# EAGLE schematic SwitchBoard (EAGLE 7.2.0)

## Sheet 1 of 5: Battery_Power
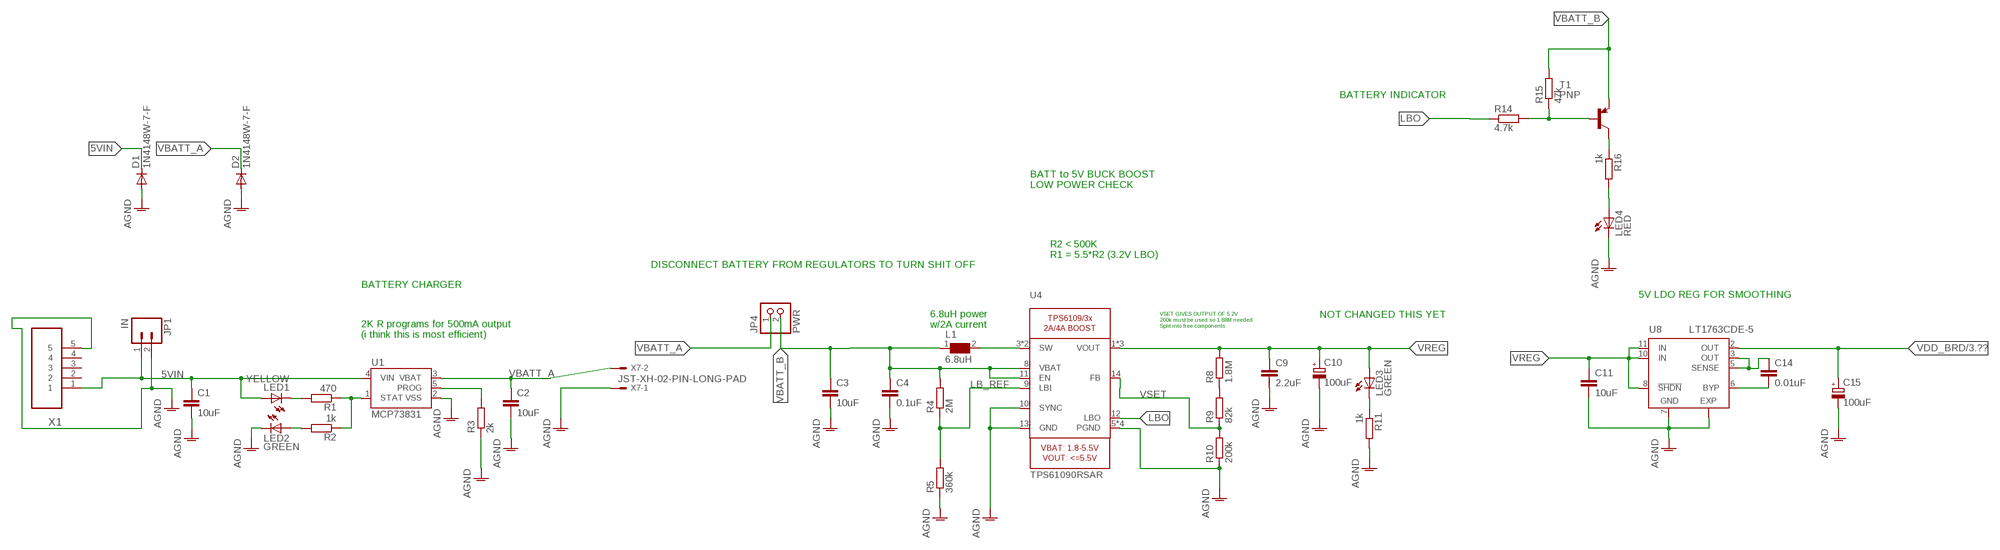
[diagram p0: schematic, sheet 1]

### Parts
C1  10uF  C-EUC0805  [C0805]
C2  10uF  C-EUC0805  [C0805]
C3  10uF  C-EUC0805  [C0805]
C4  0.1uF  C-EUC0805  [C0805]
C9  2.2uF  C-EUC0805  [C0805]
C10  100uF  CPOL-EUCT6032  [CT6032]
C11  10uF  C-EUC0805  [C0805]
C14  0.01uF  C-EUC0805  [C0805]
C15  100uF  CPOL-EUCT6032  [CT6032]
D1  1N4148W-7-F  DIODE-SOD123  [SOD123]
D2  1N4148W-7-F  DIODE-SOD123  [SOD123]
JP1  IN  M02PTH  [1X02]
JP4  PWR  PINHD-1X2  [1X02]
L1  6.8uH  WE-PD-7447779006_7332/7345_PLASTIC_BASE  [WE-PD_7332/7345_PLASTIC_BASE]
LED1  YELLOW  LEDSML0805  [SML0805]
LED2  GREEN  LEDSML0805  [SML0805]
LED3  GREEN  LEDSML0805  [SML0805]
LED4  RED  LEDSML0805  [SML0805]
R1  470  R-EU_M0805  [M0805]
R2  1k  R-EU_M0805  [M0805]
R3  2k  R-EU_M0805  [M0805]
R4  2M  R-EU_M0805  [M0805]
R5  360k  R-EU_M0805  [M0805]
R8  1.8M  R-EU_M0805  [M0805]
R9  82k  R-EU_M0805  [M0805]
R10  200k  R-EU_M0805  [M0805]
R11  1k  R-EU_M0805  [M0805]
R14  4.7k  R-EU_M0805  [M0805]
R15  47k  R-EU_M0805  [M0805]
R16  1k  R-EU_M0805  [M0805]
T1  PNP  BC807-40-PNP-SOT23-BEC  [SOT23-BEC]
U1  MCP73831  [SOT23-5]
U4  TPS61090RSAR  VREG_TPS6103XSPARKFUNVERSION  [QFN16-4X4]
U8  LT1763CDE-5  [DFN12]
X1  47346-0001  [MOLEX_47346-0001]
X7  JST-XH-02-PIN-LONG-PAD  [JST-XH-02-PACKAGE-LONG-PAD]

### Nets
5VIN: C1.1 D1.C JP1.1 LED1.A U1.4(VIN) X1.1
AGND: C1.2 C2.2 C3.2 C4.2 C9.2 C10.- C11.2 C15.- D1.A D2.A JP1.2 LED2.C LED4.C R3.1 R5.1 R10.1 R11.2 U1.2(VSS) U4.5(PGND) U4.6(PGND) U4.7(PGND) U4.10(SYNC) U4.13(GND) U4.EXP(PGND) U8.7(GND) U8.EXP X1.5 X7.1 ; also sheet 2,3,4
CHRG: LED1.C R1.2
LB_REF: R4.1 R5.2 U4.9(LBI)
LBO: R14.1 U4.12(LBO)
N$3: C14.1 U8.3(OUT) U8.5(SENSE)
N$4: C14.2 U8.6(BYP)
N$5: LED2.A R2.2
N$6: R8.1 R9.2
N$7: LED3.C R11.1
N$8: R16.1 T1.C
N$9: LED4.A R16.2
N$11: R14.2 R15.1 T1.B
PROG: R3.2 U1.5(PROG)
STAT: R1.1 R2.1 U1.1(STAT)
SW: L1.2 U4.3(SW) U4.4(SW)
VBATT_A: C2.1 D2.C JP4.1 U1.3(VBAT) X7.2
VBATT_B: C3.1 C4.1 JP4.2 L1.1 R4.2 R15.2 T1.E U4.8(VBAT) U4.11(EN)
VDD_BRD: C15.+ U8.2(OUT) ; also sheet 3,4
VREG: C9.1 C10.+ C11.1 LED3.A R8.2 U4.1(VOUT) U4.15(VOUT) U4.16(VOUT) U8.8(!SHDN) U8.10(IN) U8.11(IN)
VSET: R9.1 R10.2 U4.14(FB)
Unconnected: X1.2 X1.3 X1.4

### Notes on the sheet
- BATTERY INDICATOR
- BATT to 5V BUCK BOOST
  LOW POWER CHECK
- R2 < 500K
  R1 = 5.5*R2 (3.2V LBO)
- DISCONNECT BATTERY FROM REGULATORS TO TURN SHIT OFF
- BATTERY CHARGER
- 5V LDO REG FOR SMOOTHING
- NOT CHANGED THIS YET
- 6.8uH power
  w/2A current
- VSET GIVES OUTPUT OF 5.2V
  200k must be used so 1.88M needed
  Split into free components
- 2K R programs for 500mA output
  (i think this is most efficient)

## Sheet 2 of 5: Switches
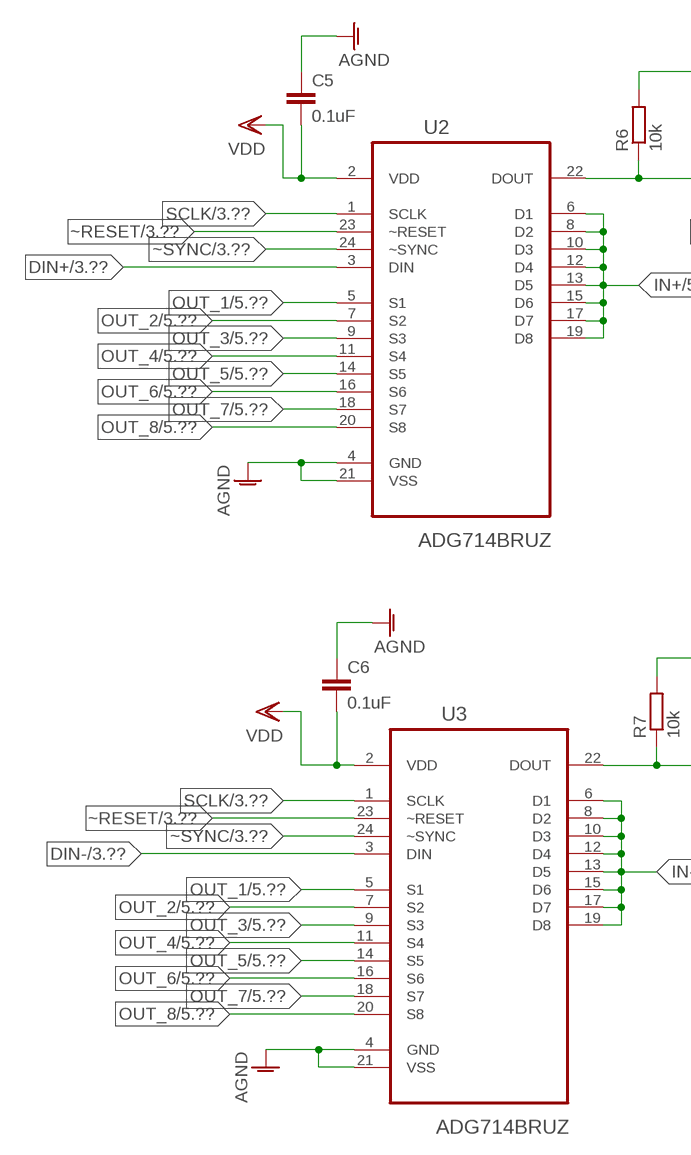
[diagram p1: schematic, sheet 2, part 1 of 2]
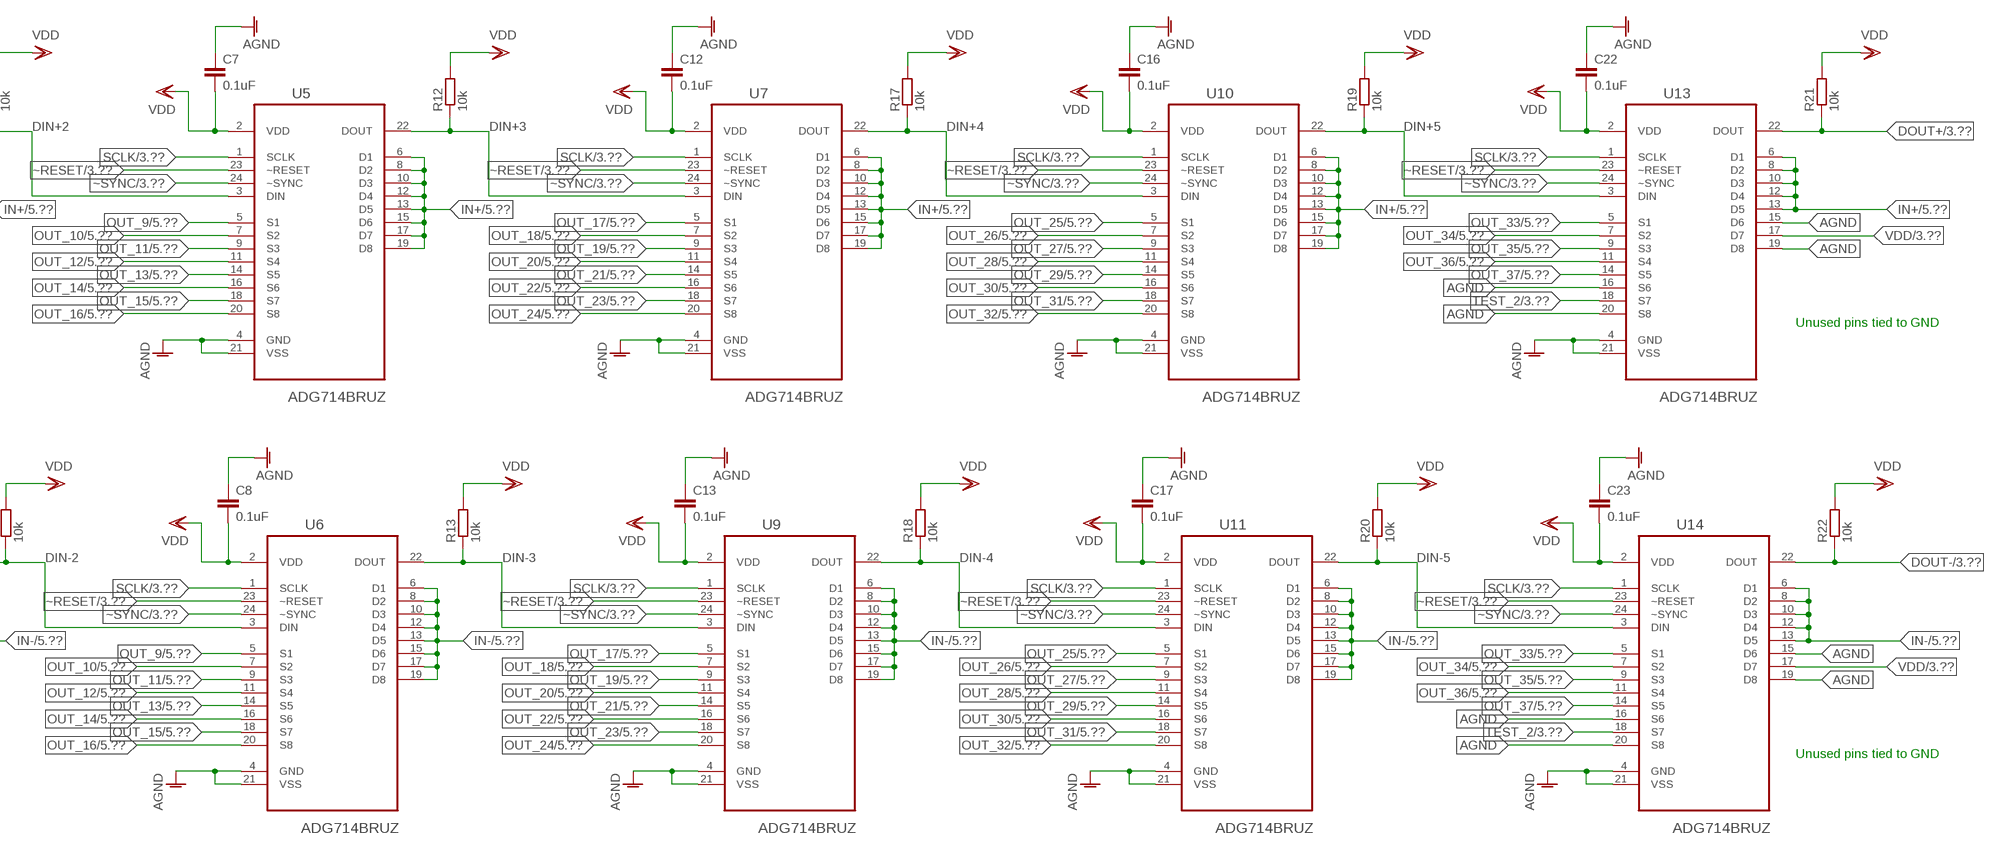
[diagram p2: schematic, sheet 2, part 2 of 2]

### Parts
C5  0.1uF  C-EUC0805  [C0805]
C6  0.1uF  C-EUC0805  [C0805]
C7  0.1uF  C-EUC0805  [C0805]
C8  0.1uF  C-EUC0805  [C0805]
C12  0.1uF  C-EUC0805  [C0805]
C13  0.1uF  C-EUC0805  [C0805]
C16  0.1uF  C-EUC0805  [C0805]
C17  0.1uF  C-EUC0805  [C0805]
C22  0.1uF  C-EUC0805  [C0805]
C23  0.1uF  C-EUC0805  [C0805]
R6  10k  R-EU_M0805  [M0805]
R7  10k  R-EU_M0805  [M0805]
R12  10k  R-EU_M0805  [M0805]
R13  10k  R-EU_M0805  [M0805]
R17  10k  R-EU_M0805  [M0805]
R18  10k  R-EU_M0805  [M0805]
R19  10k  R-EU_M0805  [M0805]
R20  10k  R-EU_M0805  [M0805]
R21  10k  R-EU_M0805  [M0805]
R22  10k  R-EU_M0805  [M0805]
U2  ADG714BRUZ  [SOP65P640X120-24N]
U3  ADG714BRUZ  [SOP65P640X120-24N]
U5  ADG714BRUZ  [SOP65P640X120-24N]
U6  ADG714BRUZ  [SOP65P640X120-24N]
U7  ADG714BRUZ  [SOP65P640X120-24N]
U9  ADG714BRUZ  [SOP65P640X120-24N]
U10  ADG714BRUZ  [SOP65P640X120-24N]
U11  ADG714BRUZ  [SOP65P640X120-24N]
U13  ADG714BRUZ  [SOP65P640X120-24N]
U14  ADG714BRUZ  [SOP65P640X120-24N]

### Nets
AGND: C5.1 C6.1 C7.1 C8.1 C12.1 C13.1 C16.1 C17.1 C22.1 C23.1 U2.4(GND) U2.21(VSS) U3.4(GND) U3.21(VSS) U5.4(GND) U5.21(VSS) U6.4(GND) U6.21(VSS) U7.4(GND) U7.21(VSS) U9.4(GND) U9.21(VSS) U10.4(GND) U10.21(VSS) U11.4(GND) U11.21(VSS) U13.4(GND) U13.15(D6) U13.16(S6) U13.19(D8) U13.20(S8) U13.21(VSS) U14.4(GND) U14.15(D6) U14.16(S6) U14.19(D8) U14.20(S8) U14.21(VSS) ; also sheet 1,3,4
DIN+: U2.3(DIN) ; also sheet 3
DIN+2: R6.1 U2.22(DOUT) U5.3(DIN)
DIN+3: R12.1 U5.22(DOUT) U7.3(DIN)
DIN+4: R17.1 U7.22(DOUT) U10.3(DIN)
DIN+5: R19.1 U10.22(DOUT) U13.3(DIN)
DIN-: U3.3(DIN) ; also sheet 3
DIN-2: R7.1 U3.22(DOUT) U6.3(DIN)
DIN-3: R13.1 U6.22(DOUT) U9.3(DIN)
DIN-4: R18.1 U9.22(DOUT) U11.3(DIN)
DIN-5: R20.1 U11.22(DOUT) U14.3(DIN)
DOUT+: R21.1 U13.22(DOUT) ; also sheet 3
DOUT-: R22.1 U14.22(DOUT) ; also sheet 3
IN+: U2.6(D1) U2.8(D2) U2.10(D3) U2.12(D4) U2.13(D5) U2.15(D6) U2.17(D7) U2.19(D8) U5.6(D1) U5.8(D2) U5.10(D3) U5.12(D4) U5.13(D5) U5.15(D6) U5.17(D7) U5.19(D8) U7.6(D1) U7.8(D2) U7.10(D3) U7.12(D4) U7.13(D5) U7.15(D6) U7.17(D7) U7.19(D8) U10.6(D1) U10.8(D2) U10.10(D3) U10.12(D4) U10.13(D5) U10.15(D6) U10.17(D7) U10.19(D8) U13.6(D1) U13.8(D2) U13.10(D3) U13.12(D4) U13.13(D5) ; also sheet 5
IN-: U3.6(D1) U3.8(D2) U3.10(D3) U3.12(D4) U3.13(D5) U3.15(D6) U3.17(D7) U3.19(D8) U6.6(D1) U6.8(D2) U6.10(D3) U6.12(D4) U6.13(D5) U6.15(D6) U6.17(D7) U6.19(D8) U9.6(D1) U9.8(D2) U9.10(D3) U9.12(D4) U9.13(D5) U9.15(D6) U9.17(D7) U9.19(D8) U11.6(D1) U11.8(D2) U11.10(D3) U11.12(D4) U11.13(D5) U11.15(D6) U11.17(D7) U11.19(D8) U14.6(D1) U14.8(D2) U14.10(D3) U14.12(D4) U14.13(D5) ; also sheet 5
OUT_1: U2.5(S1) U3.5(S1) ; also sheet 5
OUT_2: U2.7(S2) U3.7(S2) ; also sheet 5
OUT_3: U2.9(S3) U3.9(S3) ; also sheet 5
OUT_4: U2.11(S4) U3.11(S4) ; also sheet 5
OUT_5: U2.14(S5) U3.14(S5) ; also sheet 5
OUT_6: U2.16(S6) U3.16(S6) ; also sheet 5
OUT_7: U2.18(S7) U3.18(S7) ; also sheet 5
OUT_8: U2.20(S8) U3.20(S8) ; also sheet 5
OUT_9: U5.5(S1) U6.5(S1) ; also sheet 5
OUT_10: U5.7(S2) U6.7(S2) ; also sheet 5
OUT_11: U5.9(S3) U6.9(S3) ; also sheet 5
OUT_12: U5.11(S4) U6.11(S4) ; also sheet 5
OUT_13: U5.14(S5) U6.14(S5) ; also sheet 5
OUT_14: U5.16(S6) U6.16(S6) ; also sheet 5
OUT_15: U5.18(S7) U6.18(S7) ; also sheet 5
OUT_16: U5.20(S8) U6.20(S8) ; also sheet 5
OUT_17: U7.5(S1) U9.5(S1) ; also sheet 5
OUT_18: U7.7(S2) U9.7(S2) ; also sheet 5
OUT_19: U7.9(S3) U9.9(S3) ; also sheet 5
OUT_20: U7.11(S4) U9.11(S4) ; also sheet 5
OUT_21: U7.14(S5) U9.14(S5) ; also sheet 5
OUT_22: U7.16(S6) U9.16(S6) ; also sheet 5
OUT_23: U7.18(S7) U9.18(S7) ; also sheet 5
OUT_24: U7.20(S8) U9.20(S8) ; also sheet 5
OUT_25: U10.5(S1) U11.5(S1) ; also sheet 5
OUT_26: U10.7(S2) U11.7(S2) ; also sheet 5
OUT_27: U10.9(S3) U11.9(S3) ; also sheet 5
OUT_28: U10.11(S4) U11.11(S4) ; also sheet 5
OUT_29: U10.14(S5) U11.14(S5) ; also sheet 5
OUT_30: U10.16(S6) U11.16(S6) ; also sheet 5
OUT_31: U10.18(S7) U11.18(S7) ; also sheet 5
OUT_32: U10.20(S8) U11.20(S8) ; also sheet 5
OUT_33: U13.5(S1) U14.5(S1) ; also sheet 5
OUT_34: U13.7(S2) U14.7(S2) ; also sheet 5
OUT_35: U13.9(S3) U14.9(S3) ; also sheet 5
OUT_36: U13.11(S4) U14.11(S4) ; also sheet 5
OUT_37: U13.14(S5) U14.14(S5) ; also sheet 5
SCLK: U2.1(SCLK) U3.1(SCLK) U5.1(SCLK) U6.1(SCLK) U7.1(SCLK) U9.1(SCLK) U10.1(SCLK) U11.1(SCLK) U13.1(SCLK) U14.1(SCLK) ; also sheet 3
TEST_2: U13.18(S7) U14.18(S7) ; also sheet 3,4
VDD: C5.2 C6.2 C7.2 C8.2 C12.2 C13.2 C16.2 C17.2 C22.2 C23.2 R6.2 R7.2 R12.2 R13.2 R17.2 R18.2 R19.2 R20.2 R21.2 R22.2 U2.2(VDD) U3.2(VDD) U5.2(VDD) U6.2(VDD) U7.2(VDD) U9.2(VDD) U10.2(VDD) U11.2(VDD) U13.2(VDD) U13.17(D7) U14.2(VDD) U14.17(D7) ; also sheet 3,4
~RESET: U2.23(~RESET) U3.23(~RESET) U5.23(~RESET) U6.23(~RESET) U7.23(~RESET) U9.23(~RESET) U10.23(~RESET) U11.23(~RESET) U13.23(~RESET) U14.23(~RESET) ; also sheet 3
~SYNC: U2.24(~SYNC) U3.24(~SYNC) U5.24(~SYNC) U6.24(~SYNC) U7.24(~SYNC) U9.24(~SYNC) U10.24(~SYNC) U11.24(~SYNC) U13.24(~SYNC) U14.24(~SYNC) ; also sheet 3

### Notes on the sheet
- Unused pins tied to GND
- Unused pins tied to GND

## Sheet 3 of 5: Arduino_Comm
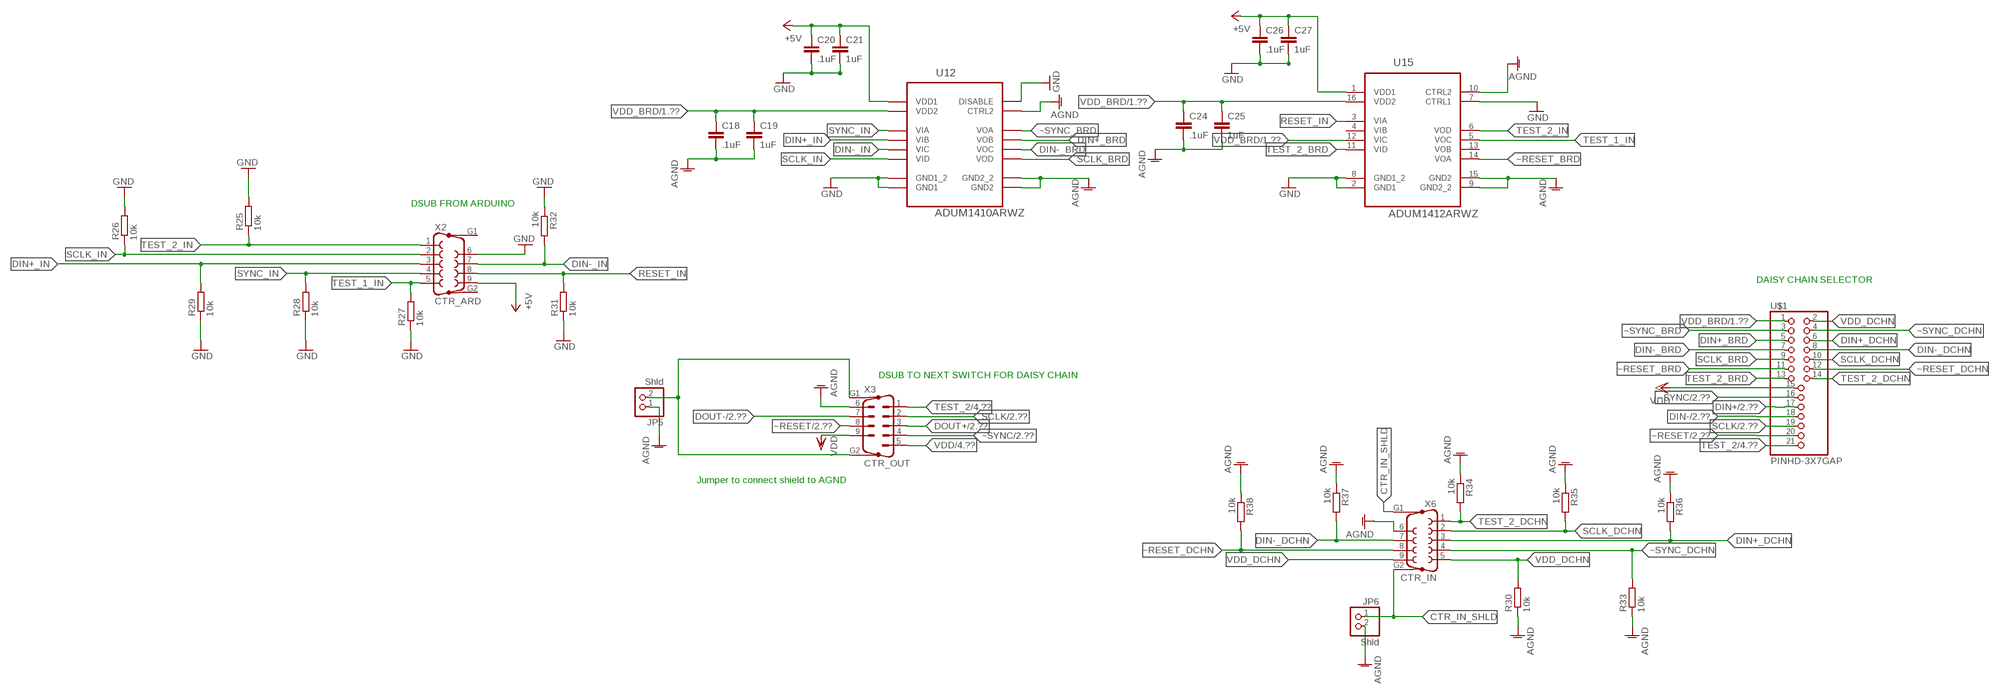
[diagram p3: schematic, sheet 3]

### Parts
C18  .1uF  C-EUC0805  [C0805]
C19  1uF  C-EUC0805  [C0805]
C20  .1uF  C-EUC0805  [C0805]
C21  1uF  C-EUC0805  [C0805]
C24  .1uF  C-EUC0805  [C0805]
C25  1uF  C-EUC0805  [C0805]
C26  .1uF  C-EUC0805  [C0805]
C27  1uF  C-EUC0805  [C0805]
JP5  Shld  PINHD-1X2  [1X02]
JP6  Shld  PINHD-1X2  [1X02]
R25  10k  R-EU_R0402  [R0402]
R26  10k  R-EU_R0402  [R0402]
R27  10k  R-EU_R0402  [R0402]
R28  10k  R-EU_R0402  [R0402]
R29  10k  R-EU_R0402  [R0402]
R30  10k  R-EU_R0402  [R0402]
R31  10k  R-EU_R0402  [R0402]
R32  10k  R-EU_R0402  [R0402]
R33  10k  R-EU_R0402  [R0402]
R34  10k  R-EU_R0402  [R0402]
R35  10k  R-EU_R0402  [R0402]
R36  10k  R-EU_R0402  [R0402]
R37  10k  R-EU_R0402  [R0402]
R38  10k  R-EU_R0402  [R0402]
U12  ADUM1410ARWZ  [SOIC127P1032X265-16N]
U15  ADUM1412ARWZ  [SOIC127P1032X265-16N]
U$1  PINHD-3X7GAP  [3X07]
X2  CTR_ARD  F09HP  [F09HP]
X3  CTR_OUT  M09HP  [M09HP]
X6  CTR_IN  F09HP  [F09HP]

### Nets
+5V: C20.1 C21.1 C26.1 C27.1 U12.1(VDD1) U15.1(VDD1) X2.9
AGND: C18.2 C19.2 C24.2 C25.2 JP5.1 JP6.2 R30.1 R33.1 R34.1 R35.1 R36.1 R37.1 R38.1 U12.9(GND2_2) U12.10(CTRL2) U12.15(GND2) U15.9(GND2_2) U15.10(CTRL2) U15.15(GND2) X3.6 X6.6 ; also sheet 1,2,4
CTR_IN_SHLD: JP6.1 X6.G1 X6.G2
DIN+: U$1.17 ; also sheet 2
DIN+_BRD: U12.13(VOB) U$1.5
DIN+_DCHN: R36.2 U$1.6 X6.3
DIN+_IN: R29.2 U12.4(VIB) X2.3
DIN-: U$1.18 ; also sheet 2
DIN-_BRD: U12.12(VOC) U$1.7
DIN-_DCHN: R37.2 U$1.8 X6.7
DIN-_IN: R32.2 U12.5(VIC) X2.7
DOUT+: X3.3 ; also sheet 2
DOUT-: X3.7 ; also sheet 2
GND: C20.2 C21.2 C26.2 C27.2 R25.2 R26.2 R27.1 R28.1 R29.1 R31.1 R32.1 U12.2(GND1_2) U12.7(DISABLE) U12.8(GND1) U15.2(GND1) U15.7(CTRL1) U15.8(GND1_2) X2.6
N$10: JP5.2 X3.G1 X3.G2
RESET_IN: R31.2 U15.3(VIA) X2.8
SCLK: U$1.19 X3.2 ; also sheet 2
SCLK_BRD: U12.11(VOD) U$1.9
SCLK_DCHN: R35.2 U$1.10 X6.2
SCLK_IN: R26.1 U12.6(VID) X2.2
SYNC_IN: R28.2 U12.3(VIA) X2.4
TEST_1_IN: R27.2 U15.5(VOC) X2.5
TEST_2: U$1.21 X3.1 ; also sheet 2,4
TEST_2_BRD: U15.11(VID) U$1.13
TEST_2_DCHN: R34.2 U$1.14 X6.1
TEST_2_IN: R25.1 U15.6(VOD) X2.1
VDD: U$1.15 X3.5 X3.9 ; also sheet 2,4
VDD_BRD: C18.1 C19.1 C24.1 C25.1 U12.16(VDD2) U15.12(VIC) U15.16(VDD2) U$1.1 ; also sheet 1,4
VDD_DCHN: R30.2 U$1.2 X6.5 X6.9
~RESET: U$1.20 X3.8 ; also sheet 2
~RESET_BRD: U15.14(VOA) U$1.11
~RESET_DCHN: R38.2 U$1.12 X6.8
~SYNC: U$1.16 X3.4 ; also sheet 2
~SYNC_BRD: U12.14(VOA) U$1.3
~SYNC_DCHN: R33.2 U$1.4 X6.4
Unconnected: U15.4(VIB) U15.13(VOB) X2.G1 X2.G2

### Notes on the sheet
- DSUB FROM ARDUINO
- DAISY CHAIN SELECTOR
- DSUB TO NEXT SWITCH FOR DAISY CHAIN
- Jumper to connect shield to AGND

## Sheet 4 of 5: Test_connections
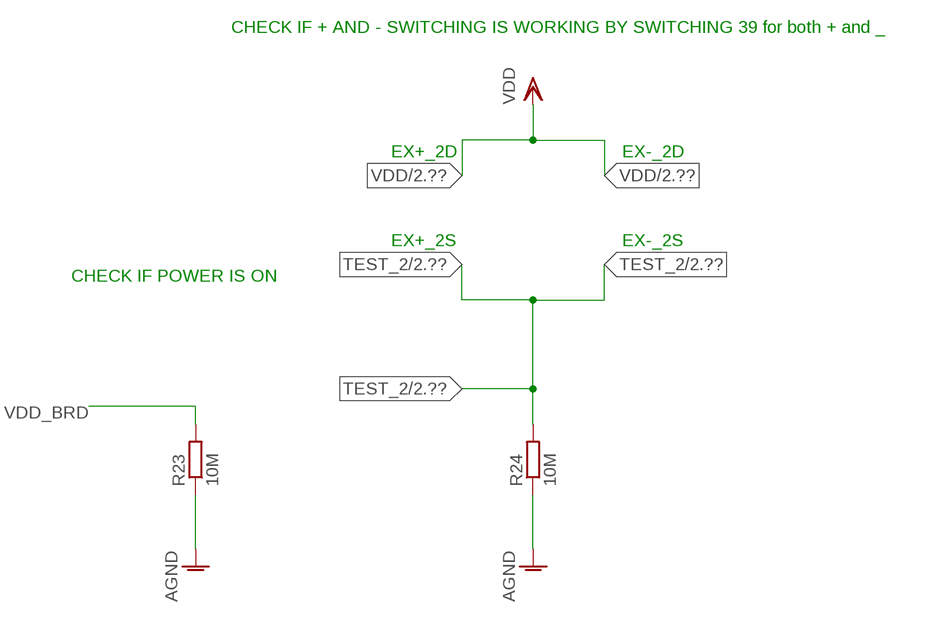
[diagram p4: schematic, sheet 4]

### Parts
R23  10M  R-EU_M0805  [M0805]
R24  10M  R-EU_M0805  [M0805]

### Nets
AGND: R23.1 R24.1 ; also sheet 1,2,3
TEST_2: R24.2 ; also sheet 2,3
VDD_BRD: R23.2 ; also sheet 1,3

### Notes on the sheet
- CHECK IF + AND - SWITCHING IS WORKING BY SWITCHING 39 for both + and _
- EX+_2D | EX-_2D
- EX+_2S | EX-_2S
- CHECK IF POWER IS ON

## Sheet 5 of 5: EEG_CS_Connections
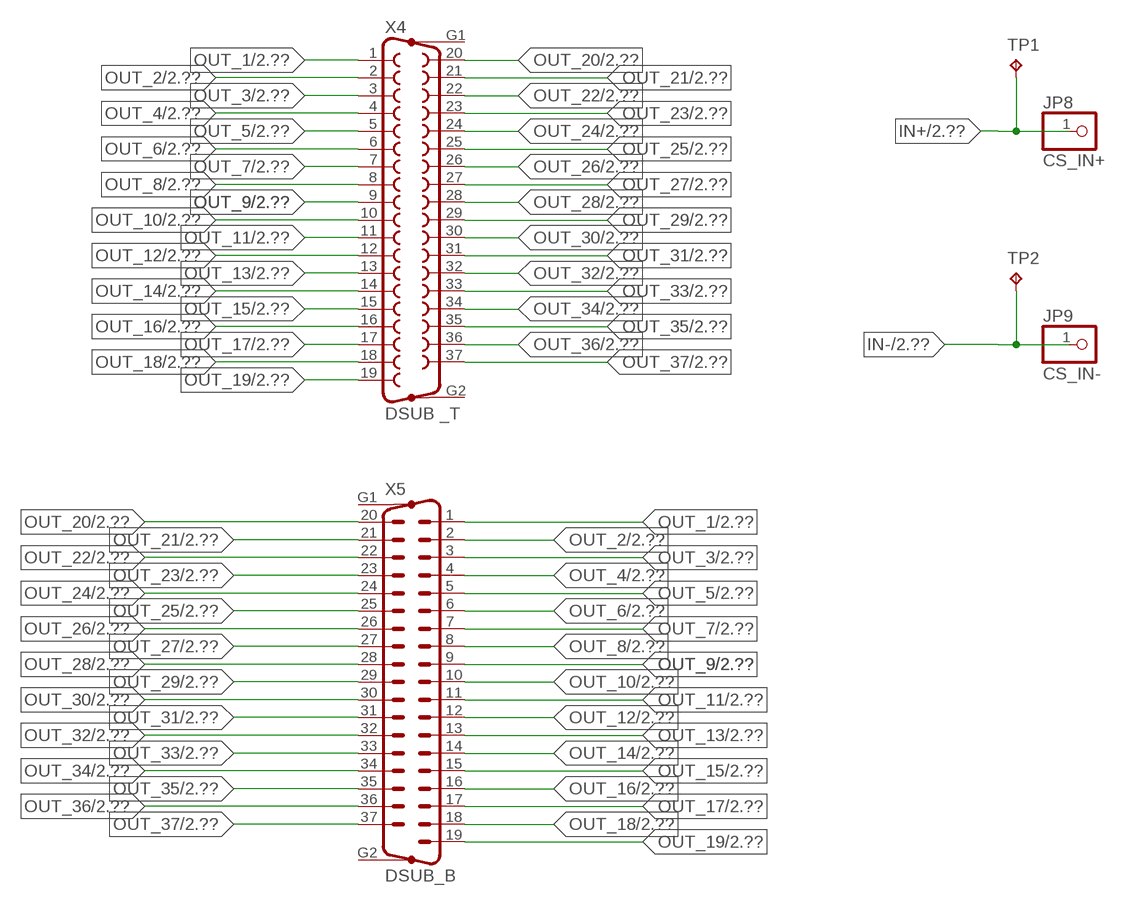
[diagram p5: schematic, sheet 5]

### Parts
JP8  CS_IN+  PINHD-1X1  [1X01]
JP9  CS_IN-  PINHD-1X1  [1X01]
TP1  TPPAD1-20  [P1-20]
TP2  TPPAD1-20  [P1-20]
X4  DSUB _T  F37HP  [F37HP]
X5  DSUB_B  M37HP  [M37HP]

### Nets
IN+: JP8.1 TP1.TP ; also sheet 2
IN-: JP9.1 TP2.TP ; also sheet 2
OUT_1: X4.1 X5.1 ; also sheet 2
OUT_2: X4.2 X5.2 ; also sheet 2
OUT_3: X4.3 X5.3 ; also sheet 2
OUT_4: X4.4 X5.4 ; also sheet 2
OUT_5: X4.5 X5.5 ; also sheet 2
OUT_6: X4.6 X5.6 ; also sheet 2
OUT_7: X4.7 X5.7 ; also sheet 2
OUT_8: X4.8 X5.8 ; also sheet 2
OUT_9: X4.9 X5.9 ; also sheet 2
OUT_10: X4.10 X5.10 ; also sheet 2
OUT_11: X4.11 X5.11 ; also sheet 2
OUT_12: X4.12 X5.12 ; also sheet 2
OUT_13: X4.13 X5.13 ; also sheet 2
OUT_14: X4.14 X5.14 ; also sheet 2
OUT_15: X4.15 X5.15 ; also sheet 2
OUT_16: X4.16 X5.16 ; also sheet 2
OUT_17: X4.17 X5.17 ; also sheet 2
OUT_18: X4.18 X5.18 ; also sheet 2
OUT_19: X4.19 X5.19 ; also sheet 2
OUT_20: X4.20 X5.20 ; also sheet 2
OUT_21: X4.21 X5.21 ; also sheet 2
OUT_22: X4.22 X5.22 ; also sheet 2
OUT_23: X4.23 X5.23 ; also sheet 2
OUT_24: X4.24 X5.24 ; also sheet 2
OUT_25: X4.25 X5.25 ; also sheet 2
OUT_26: X4.26 X5.26 ; also sheet 2
OUT_27: X4.27 X5.27 ; also sheet 2
OUT_28: X4.28 X5.28 ; also sheet 2
OUT_29: X4.29 X5.29 ; also sheet 2
OUT_30: X4.30 X5.30 ; also sheet 2
OUT_31: X4.31 X5.31 ; also sheet 2
OUT_32: X4.32 X5.32 ; also sheet 2
OUT_33: X4.33 X5.33 ; also sheet 2
OUT_34: X4.34 X5.34 ; also sheet 2
OUT_35: X4.35 X5.35 ; also sheet 2
OUT_36: X4.36 X5.36 ; also sheet 2
OUT_37: X4.37 X5.37 ; also sheet 2
Unconnected: X4.G1 X4.G2 X5.G1 X5.G2

## Library data of the parts
C1-C9 C11-C14 C16-C27 = resistor:C-EU: CAPACITOR, European symbol
C10 C15 = rcl:CPOL-EU: POLARIZED CAPACITOR, European symbol
D1 D2 = diode:DIODE-: DIODE
JP1 = SparkFun:M02: Header 2 Standard 2-pin 0.1" header. Use with straight break away headers (SKU : PRT-00116), right angle break away headers (PRT-00553), swiss pins (PRT-00743), machine pins (PRT-00117), and female headers (PRT-00115). Molex polarized connector foot print use with SKU : PRT-08233 with associated crimp pins and housings.
JP4-JP6 = pinhead:PINHD-1X2: PIN HEADER
JP8 JP9 = pinhead:PINHD-1X1: PIN HEADER
L1 = WE-PD:WE-PD: SMD-Shielded Power Inductors WE-PD - Magnetically shielded version which results in a low leakage field - High storage capacity - Low self-losses - Highest possible current loading for SMD-Inducors -- Switching regulators with low operating voltages (computer, laptop, mobile phones, pagers) -- Integrated DC/DC-converter -- Is recommended for the application with switching regulators from National Semiconductor, Linear Technology, Texas Instruments and Fairchild Semiconductor, ect. -- Graphic cards -- Plastic base: Because of the one piece construction these are more suitable for high vibration or shock applications; MPN: 7447779006; OC_FARNELL: 1635987; OC_NEWARK: 08P2857; PACKAGE: 7345; SUPPLIER: Wuerth Elektronik
LED1-LED4 = led:LED: LED OSRAM: - CHIPLED LG R971, LG N971, LY N971, LG Q971, LY Q971, LO R971, LY R971 LH N974, LH R974 LS Q976, LO Q976, LY Q976 LO Q996 - Hyper CHIPLED LW Q18S LB Q993, LB Q99A, LB R99A - SideLED LS A670, LO A670, LY A670, LG A670, LP A670 LB A673, LV A673, LT A673, LW A673 LH A674 LY A675 LS A676, LA A676, LO A676, LY A676, LW A676 LS A679, LY A679, LG A679 - Hyper Micro SIDELED® LS Y876, LA Y876, LO Y876, LY Y876 LT Y87S - SmartLED LW L88C, LW L88S LB L89C, LB L89S, LG L890 LS L89K, LO L89K, LY L89K LS L896, LA L896, LO L896, LY L896 - TOPLED LS T670, LO T670, LY T670, LG T670, LP T670 LSG T670, LSP T670, LSY T670, LOP T670, LYG T670 LG T671, LOG T671, LSG T671 LB T673, LV T673, LT T673, LW T673 LH T674 LS T676, LA T676, LO T676, LY T676, LB T676, LH T676, LSB T676, LW T676 LB T67C, LV T67C, LT T67C, LS T67K, LO T67K, LY T67K, LW E67C LS E67B, LA E67B, LO E67B, LY E67B, LB E67C, LV E67C, LT E67C LW T67C LS T679, LY T679, LG T679 LS T770, LO T770, LY T770, LG T770, LP T770 LB T773, LV T773, LT T773, LW T773 LH T774 LS E675, LA E675, LY E675, LS T675 LS T776, LA T776, LO T776, LY T776, LB T776 LHGB T686 LT T68C, LB T68C - Hyper Mini TOPLED® LB M676 - Mini TOPLED Santana® LG M470 LS M47K, LO M47K, LY M47K Source: http://www.osram.convergy.de LUXEON: - LUMILED® LXK2-PW12-R00, LXK2-PW12-S00, LXK2-PW14-U00, LXK2-PW14-V00 LXK2-PM12-R00, LXK2-PM12-S00, LXK2-PM14-U00 LXK2-PE12-Q00, LXK2-PE12-R00, LXK2-PE12-S00, LXK2-PE14-T00, LXK2-PE14-U00 LXK2-PB12-K00, LXK2-PB12-L00, LXK2-PB12-M00, LXK2-PB14-N00, LXK2-PB14-P00, LXK2-PB14-Q00 LXK2-PR12-L00, LXK2-PR12-M00, LXK2-PR14-Q00, LXK2-PR14-R00 LXK2-PD12-Q00, LXK2-PD12-R00, LXK2-PD12-S00 LXK2-PH12-R00, LXK2-PH12-S00 LXK2-PL12-P00, LXK2-PL12-Q00, LXK2-PL12-R00 Source: www.luxeon.com KINGBRIGHT: KA-3528ASYC Source: www.kingbright.com
R1-R38 = rcl:R-EU_: RESISTOR, European symbol
T1 = transistor:*-PNP-: PNP Transistror
TP1 TP2 = testpad:TP: Test pad
U1 = SparkFun-PowerIC:MCP73831: Miniature single cell, fully integrated Li-Ion, Li-polymer charge management controller http://ww1.microchip.com/downloads/en/DeviceDoc/20001984g.pdf IC-09995; PROD_ID: IC-09995
U2 U3 U5-U7 U9-U11 U13 U14 = Analog Devices_By_element14_Batch_1:ADG714BRUZ: CMOS, Low Voltage Serially Controlled, Octal SPST Switches; MPN: ADG714BRUZ; OC_FARNELL: 9604367; OC_NEWARK: 59K1531; PACKAGE: TSSOP-24; SUPPLIER: Analog Devices
U4 = Adafruit PowerBoost 500C:VREG_TPS6103X: TPS6103x 4A Boost - 1.8-5.5V Input, Adjustable Output to 5.5V
U8 = linear-technology:LT1763: 500mA, Low Noise, LDO Micropower Regulators Source: http://cds.linear.com/docs/Datasheet/1763ff.pdf; MPN: LT1763CDE-5; OC_FARNELL: 1556468; OC_NEWARK: 57M6035
U12 = ADI-Phase-2:ADUM1410ARWZ: ISOLATOR, DGTL, 4CHAN; MPN: ADUM1410ARWZ; OC_FARNELL: 2067770; OC_NEWARK: 73T8174; PACKAGE: 16-Lead SOIC_W; SUPPLIER: Analog Devices
U15 = ADUM1412JAMES:ADUM1412ARWZ: IC, DIG ISOLATOR; MPN: ADUM1412ARWZ; OC_FARNELL: 2377152; PACKAGE: 16-Lead SOIC_W; SUPPLIER: Analog Devices
U$1 = pinhead:PINHD-3X7GAP
X1 = Molex-47346-0001:47346-0001: CONN RCPT 5POS MICRO USB R/A SMD; MPN: 47346-0001; OC_FARNELL: 1568026; OC_NEWARK: 47M0505; PACKAGE: 5 POS MICRO USB R/A; SUPPLIER: MOLEX
X2 X6 = con-subd:F09HP: SUB-D; OC_FARNELL: unknown; OC_NEWARK: unknown
X3 = con-subd:M09HP: SUB-D; OC_FARNELL: unknown; OC_NEWARK: unknown
X4 = con-subd:F37HP: SUB-D; OC_FARNELL: unknown; OC_NEWARK: unknown
X5 = con-subd:M37HP: SUB-D; OC_FARNELL: unknown; OC_NEWARK: unknown
X7 = Rembrandt Electronics - JST XH Connectors v1-0:JST-XH-02-PIN: JST XH Connector 2 Pin Wire to board connector. Pitch: 2,54 mm, (0.100") Number of pins: 2 Created by Rembrandt Electronics www.rembrandtelectronics.com